# Altium project SC-FREYR-EPS-711, AstroYeast LED Flasher.PrjPcb
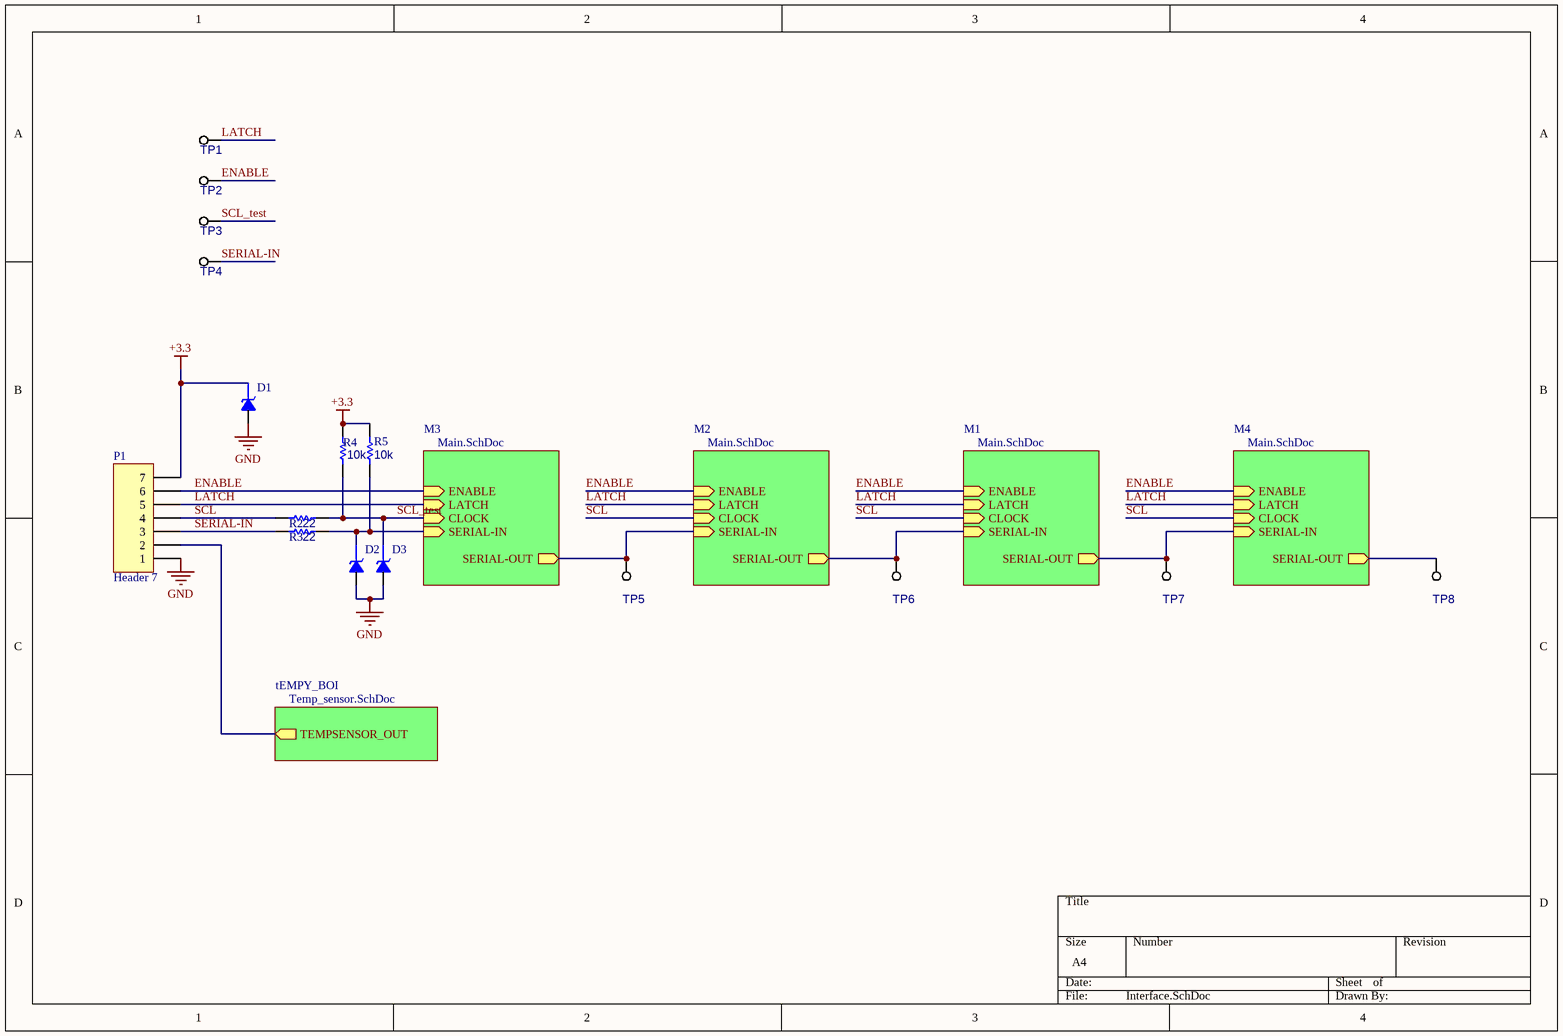
[diagram p0: Interface.SchDoc]
Circuit: AstroYeast LED Flasher; DrawingNumber: SC-FREYR-EPS-711; Project: SC-FREYR; Rev: A; RevDate: SUMMER 2023
5 sheets, 82 parts. Net scope: hierarchical (ports join the sheet entries above them; power ports are global).
Board files: Array.PcbDoc, PCB1.PcbDoc, RevB.PcbDoc
Sheets:
  Interface.SchDoc
    M1 = Main.SchDoc
      D1 = LED.SchDoc
        A = LEDBlock.SchDoc
        B = LEDBlock.SchDoc
        C = LEDBlock.SchDoc
        D = LEDBlock.SchDoc
    M2 = Main.SchDoc
      D1 = LED.SchDoc
        A = LEDBlock.SchDoc
        B = LEDBlock.SchDoc
        C = LEDBlock.SchDoc
        D = LEDBlock.SchDoc
    M3 = Main.SchDoc
      D1 = LED.SchDoc
        A = LEDBlock.SchDoc
        B = LEDBlock.SchDoc
        C = LEDBlock.SchDoc
        D = LEDBlock.SchDoc
    M4 = Main.SchDoc
      D1 = LED.SchDoc
        A = LEDBlock.SchDoc
        B = LEDBlock.SchDoc
        C = LEDBlock.SchDoc
        D = LEDBlock.SchDoc
    tEMPY_BOI = Temp_sensor.SchDoc

## Sheet Interface.SchDoc
size A4; SheetNumber: 1; SheetTotal: 5

### Parts
D1  STS521033B950  [STS521033B950_COB]  (value not drawn)
D2  STS521033B950  [STS521033B950_COB]  (value not drawn)
D3  STS521033B950  [STS521033B950_COB]  (value not drawn)
P1  Header 7  [HDR1X7]
R2  value 22  [R0603A]  (hidden comment: Resistor)
R3  value 22  [R0603A]  (hidden comment: Resistor)
R4  value 10k  [R0603A]  (hidden comment: Resistor)
R5  value 10k  [R0603A]  (hidden comment: Resistor)
TP1  Test Point  [TP-SMT-1mm]  (value not drawn)  (no BOM)
TP2  Test Point  [TP-SMT-1mm]  (value not drawn)  (no BOM)
TP3  Test Point  [TP-SMT-1mm]  (value not drawn)  (no BOM)
TP4  Test Point  [TP-SMT-1mm]  (value not drawn)  (no BOM)
TP5  Test Point  [TP-SMT-1mm]  (value not drawn)  (no BOM)
TP6  Test Point  [TP-SMT-1mm]  (value not drawn)  (no BOM)
TP7  Test Point  [TP-SMT-1mm]  (value not drawn)  (no BOM)
TP8  Test Point  [TP-SMT-1mm]  (value not drawn)  (no BOM)

### Sub-sheets
M1 = Main.SchDoc: LATCH (in), ENABLE (in), CLOCK (in), SERIAL-IN (in), SERIAL-OUT (out)
M2 = Main.SchDoc: LATCH (in), ENABLE (in), CLOCK (in), SERIAL-IN (in), SERIAL-OUT (out)
M3 = Main.SchDoc: LATCH (in), ENABLE (in), CLOCK (in), SERIAL-IN (in), SERIAL-OUT (out)
M4 = Main.SchDoc: LATCH (in), ENABLE (in), CLOCK (in), SERIAL-IN (in), SERIAL-OUT (out)
tEMPY_BOI = Temp_sensor.SchDoc: TEMPSENSOR_OUT (out)

### Nets
+3.3: D1.1(K) P1.7 R4.1 R5.1
GND: D1.2(A) D2.2(A) D3.2(A) P1.1
ENABLE: P1.6 TP2.1(Pad) ; sheet M1/ENABLE, sheet M2/ENABLE, sheet M3/ENABLE, sheet M4/ENABLE
LATCH: P1.5 TP1.1(Pad) ; sheet M1/LATCH, sheet M2/LATCH, sheet M3/LATCH, sheet M4/LATCH
SCL: P1.4 R2.2 ; sheet M1/CLOCK, sheet M2/CLOCK, sheet M4/CLOCK
SCL_test: D3.1(K) R2.1 R4.2 TP3.1(Pad) ; sheet M3/CLOCK  [project net SCL]
SDA: TP5.1(Pad) ; sheet M2/SERIAL-IN, sheet M3/SERIAL-OUT
SDA: TP6.1(Pad) ; sheet M1/SERIAL-IN, sheet M2/SERIAL-OUT  [a separate net that carries the same name]
SDA: TP7.1(Pad) ; sheet M1/SERIAL-OUT, sheet M4/SERIAL-IN  [a separate net that carries the same name]
SDA: D2.1(K) R3.1 R5.2 ; sheet M3/SERIAL-IN  [a separate net that carries the same name]
SERIAL-IN: P1.3 R3.2 TP4.1(Pad)
SERIAL-OUT: TP8.1(Pad) ; sheet M4/SERIAL-OUT
TEMPSENSOR_OUT: P1.2 ; sheet tEMPY_BOI/TEMPSENSOR_OUT

### Library data of the parts
D1-D3 = CMP-245-000001-7: 3.3V ESD Diode; Mfr_Name: Eaton / Cooper Bussmann; Type: DEV; Copyright: Copyright (C) 2023 Ultra Librarian. All rights reserved.; RefDes: RefDes; Manufacturer_Part_Number: STS521033B950; Design Item ID: STS521033B950; Source: STS521033B950.SchLib
P1 = CMP-005-000112-1: Header, 7-Pin; Signal Integrity: Connector; Design Item ID: Header 7; Component Type: Standard; Source: Miscellaneous Connectors.SchLib; LatestRevisionDate: 17-Jul-2002; LatestRevisionNote: Re-released for DXP Platform.; Publisher: Altium Limited; Pin Count: 7
R2-R5 = CMP-009-00002-14
TP1-TP8 = CMP-002-00006-5: In circuit test point for a net

## Sheet Main.SchDoc
size A4; SheetNumber: 2; SheetTotal: 5
Used 4 times, as channels M1, M2, M3, M4. Parts and nets are listed once, with the designators drawn on the sheet.
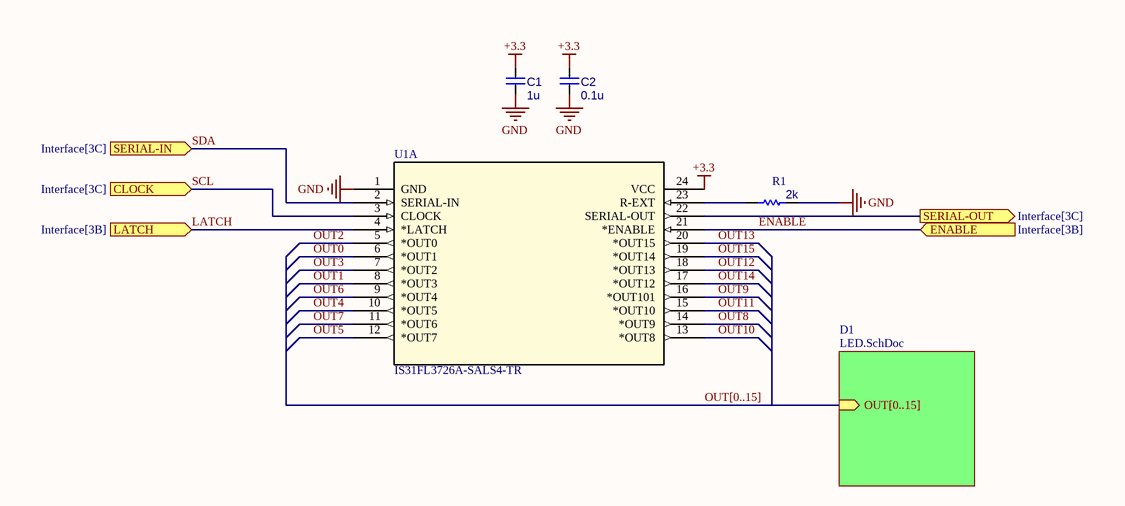
[diagram p1: Main.SchDoc]

### Parts
C1  value 1u  [C0603B]  (hidden comment: Capacitor)
C2  value 0.1u  [C0603B]  (hidden comment: Capacitor)
R1  value 2k  [R0603B]  (hidden comment: Resistor)
U1  IS31FL3726A-SALS4-TR  [SSOP-24_LMS]  (part A of 2)

### Sub-sheets
D1 = LED.SchDoc: OUT[0..15] (in)

### Ports
CLOCK (in, see Interface[3C]), ENABLE (in, see Interface[3B]), LATCH (in, see Interface[3B]), SERIAL-IN (in, see Interface[3C]), SERIAL-OUT (out, see Interface[3C])

### Nets
+3.3: C1.1 C2.1 U1.24(VCC)
GND: C1.2 C2.2 R1.2 U1.1(GND)
ENABLE: U1.21(*ENABLE) ; port ENABLE
LATCH: U1.4(*LATCH) ; port LATCH
OUT0: U1.6(*OUT1)
OUT1: U1.8(*OUT3)
OUT2: U1.5(*OUT0)
OUT3: U1.7(*OUT2)
OUT4: U1.10(*OUT5)
OUT5: U1.12(*OUT7)
OUT6: U1.9(*OUT4)
OUT7: U1.11(*OUT6)
OUT8: U1.14(*OUT9)
OUT9: U1.16(*OUT101)
OUT10: U1.13(*OUT8)
OUT11: U1.15(*OUT10)
OUT12: U1.18(*OUT13)
OUT13: U1.20(*OUT15)
OUT14: U1.17(*OUT12)
OUT15: U1.19(*OUT14)
SCL: U1.3(CLOCK) ; port CLOCK
SDA: U1.2(SERIAL-IN) ; port SERIAL-IN
SERIAL-OUT: U1.22(SERIAL-OUT) ; port SERIAL-OUT
NetR1_1: R1.1 U1.23(R-EXT)

### Channels
M1: designators end in _M1; ports CLOCK=SCL ENABLE=ENABLE LATCH=LATCH SERIAL-IN=SDA SERIAL-OUT=SDA
M2: designators end in _M2; ports CLOCK=SCL ENABLE=ENABLE LATCH=LATCH SERIAL-IN=SDA SERIAL-OUT=SDA
M3: designators end in _M3; ports CLOCK=SCL ENABLE=ENABLE LATCH=LATCH SERIAL-IN=SDA SERIAL-OUT=SDA
M4: designators end in _M4; ports CLOCK=SCL ENABLE=ENABLE LATCH=LATCH SERIAL-IN=SDA SERIAL-OUT=SERIAL-OUT

### Buses and harness runs
bus OUT[0..15] = sheet D1/OUT[0..15]

### Library data of the parts
C1 C2 = CMP-001-00000-10: Non-polarized capacitor
R1 = CMP-009-00002-14
U1 = CMP-184-000001-2: LED Driver IC 16 Output Linear Shift Register No Dimming 25.2mA 24-eTSSOP; Mfr_Name: Lumissil Microsystems; RefDes: RefDes; Design Item ID: IS31FL3726A-SALS4-TR; Type: Type; Source: IS31FL3726A-SALS4-TR.SchLib

## Sheet LED.SchDoc
size A4; SheetNumber: 3; SheetTotal: 4
Used 4 times, as channels M1/D1, M2/D1, M3/D1, M4/D1. Parts and nets are listed once, with the designators drawn on the sheet.
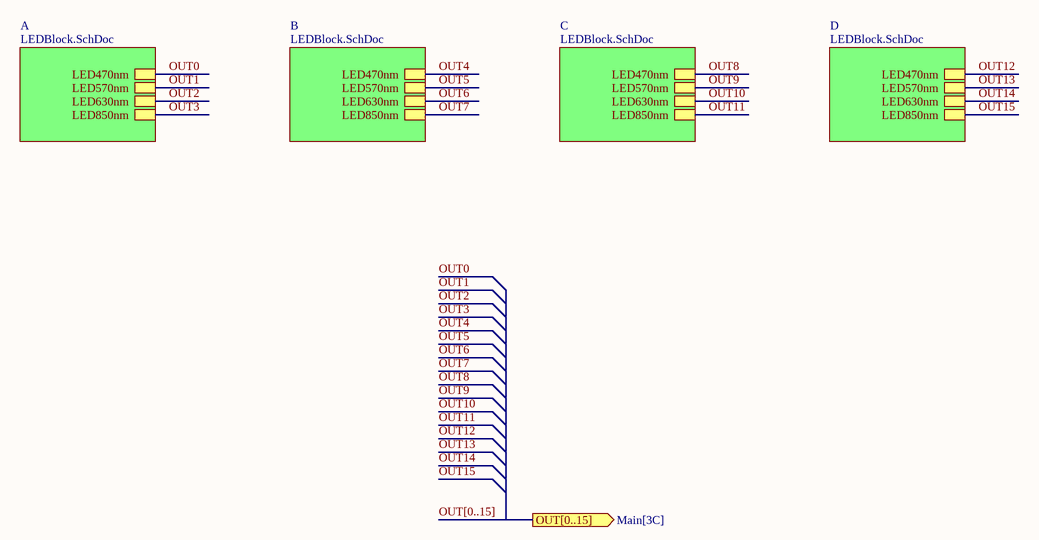
[diagram p2: LED.SchDoc]

### Sub-sheets
A = LEDBlock.SchDoc: LED470nm, LED570nm, LED630nm, LED850nm
B = LEDBlock.SchDoc: LED470nm, LED570nm, LED630nm, LED850nm
C = LEDBlock.SchDoc: LED470nm, LED570nm, LED630nm, LED850nm
D = LEDBlock.SchDoc: LED470nm, LED570nm, LED630nm, LED850nm

### Ports
OUT[0..15] (out, see Main[3C])

### Channels
M1/D1: no parts or ports
M2/D1: no parts or ports
M3/D1: no parts or ports
M4/D1: no parts or ports

### Buses and harness runs
bus OUT[0..15] = port OUT[0..15]

## Sheet LEDBlock.SchDoc
size A4; SheetNumber: 4; SheetTotal: 5
Used 16 times, as channels M1/D1/A, M1/D1/B, M1/D1/C, M1/D1/D, M2/D1/A, M2/D1/B, M2/D1/C, M2/D1/D, M3/D1/A, M3/D1/B, M3/D1/C, M3/D1/D, M4/D1/A, M4/D1/B, M4/D1/C, M4/D1/D. Parts and nets are listed once, with the designators drawn on the sheet.
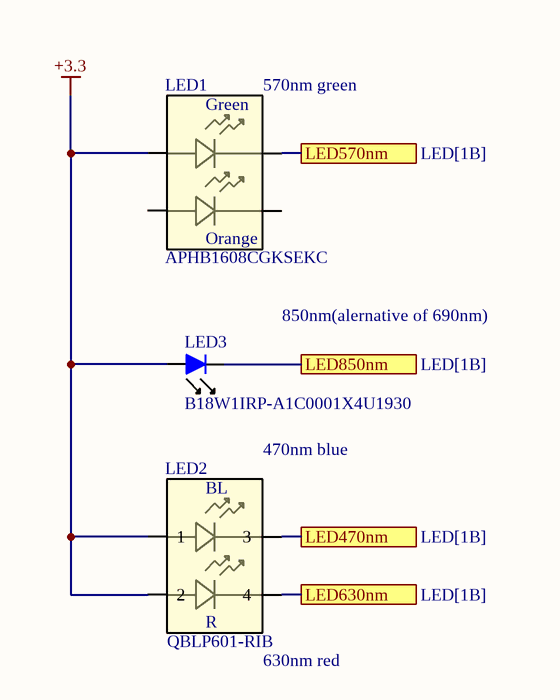
[diagram p3: LEDBlock.SchDoc]

### Parts
LED1  APHB1608CGKSEKC  [APHB1608CGKSEKC_KNB]
LED2  QBLP601-RIB  [DFN65P160X55-4N]
LED3  B18W1IRP-A1C0001X4U1930  [CAPCP1608X10N]

### Ports
LED470nm (see LED[1B]), LED570nm (see LED[1B]), LED630nm (see LED[1B]), LED850nm (see LED[1B])

### Nets
+3.3: LED1.1 LED2.1 LED2.2 LED3.2(A)
LED470nm: LED2.3 ; port LED470nm
LED570nm: LED1.2 ; port LED570nm
LED630nm: LED2.4 ; port LED630nm
LED850nm: LED3.1(K) ; port LED850nm

Not connected (* = marked no-connect by the designer): LED1 3 4

### Channels
M1/D1/A: designators end in _A1; ports LED470nm=OUT0_M1 LED570nm=OUT1_M1 LED630nm=OUT2_M1 LED850nm=OUT3_M1
M1/D1/B: designators end in _B1; ports LED470nm=OUT4_M1 LED570nm=OUT5_M1 LED630nm=OUT6_M1 LED850nm=OUT7_M1
M1/D1/C: designators end in _C1; ports LED470nm=OUT8_M1 LED570nm=OUT9_M1 LED630nm=OUT10_M1 LED850nm=OUT11_M1
M1/D1/D: designators end in _D1; ports LED470nm=OUT12_M1 LED570nm=OUT13_M1 LED630nm=OUT14_M1 LED850nm=OUT15_M1
M2/D1/A: designators end in _A2; ports LED470nm=OUT0_M2 LED570nm=OUT1_M2 LED630nm=OUT2_M2 LED850nm=OUT3_M2
M2/D1/B: designators end in _B2; ports LED470nm=OUT4_M2 LED570nm=OUT5_M2 LED630nm=OUT6_M2 LED850nm=OUT7_M2
M2/D1/C: designators end in _C2; ports LED470nm=OUT8_M2 LED570nm=OUT9_M2 LED630nm=OUT10_M2 LED850nm=OUT11_M2
M2/D1/D: designators end in _D2; ports LED470nm=OUT12_M2 LED570nm=OUT13_M2 LED630nm=OUT14_M2 LED850nm=OUT15_M2
M3/D1/A: designators end in _A3; ports LED470nm=OUT0_M3 LED570nm=OUT1_M3 LED630nm=OUT2_M3 LED850nm=OUT3_M3
M3/D1/B: designators end in _B3; ports LED470nm=OUT4_M3 LED570nm=OUT5_M3 LED630nm=OUT6_M3 LED850nm=OUT7_M3
M3/D1/C: designators end in _C3; ports LED470nm=OUT8_M3 LED570nm=OUT9_M3 LED630nm=OUT10_M3 LED850nm=OUT11_M3
M3/D1/D: designators end in _D3; ports LED470nm=OUT12_M3 LED570nm=OUT13_M3 LED630nm=OUT14_M3 LED850nm=OUT15_M3
M4/D1/A: designators end in _A4; ports LED470nm=OUT0_M4 LED570nm=OUT1_M4 LED630nm=OUT2_M4 LED850nm=OUT3_M4
M4/D1/B: designators end in _B4; ports LED470nm=OUT4_M4 LED570nm=OUT5_M4 LED630nm=OUT6_M4 LED850nm=OUT7_M4
M4/D1/C: designators end in _C4; ports LED470nm=OUT8_M4 LED570nm=OUT9_M4 LED630nm=OUT10_M4 LED850nm=OUT11_M4
M4/D1/D: designators end in _D4; ports LED470nm=OUT12_M4 LED570nm=OUT13_M4 LED630nm=OUT14_M4 LED850nm=OUT15_M4

### Notes on the sheet
- (near LED1) 570nm green
- 850nm(alernative of 690nm)
- 470nm blue
- (near LED2) 630nm red
- (in symbol CMP-007-00006-3) Green; Orange
- (in symbol CMP-007-00009-2) BL; R

### Library data of the parts
LED1 = CMP-007-00006-3: Dual Color LED, Super Bright Orange/green, Water Clear, 1.6mm; Mfr_Name: Kingbright; RoHS Compliant: Yes; Source: APHB1608CGKSEKC.SchLib; Design Item ID: APHB1608CGKSEKC
LED2 = CMP-007-00009-2: Blue, Red 470nm Blue, 630nm Red LED Indication - Discrete 3.1V Blue, 2V Red 0603 (1608 Metric)
LED3 = CMP-007-00008-2: Infrared (IR) Emitter 850nm 1.7V 100mA 23mW/sr @ 100mA (Typ) 80° 0603 (1608 Metric)

## Sheet Temp_sensor.SchDoc
size A; SheetNumber: 5; SheetTotal: 5
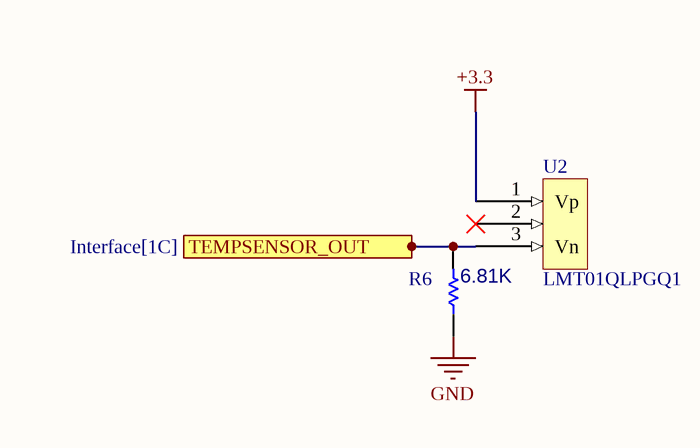
[diagram p4: Temp_sensor.SchDoc]

### Parts
R6  value 6.81K  [R0603A]  (hidden comment: Resistor)
U2  LMT01QLPGQ1  [LMT01-Q1]

### Ports
TEMPSENSOR_OUT (out, see Interface[1C])

### Nets
+3.3: U2.1(Vp)
GND: R6.1
TEMPSENSOR_OUT: R6.2 U2.3(Vn) ; port TEMPSENSOR_OUT

Not connected (* = marked no-connect by the designer): U2 2*

### Library data of the parts
R6 = CMP-009-00002-14
U2 = CMP-010-00023-4: Serial Switch/Digital Sensor, 13 Bit(s), 0.75Cel, Rectangular, Through Hole Mount; Max Supply Voltage: 5.5V; Sensor Type: TEMPERATURE SENSOR,SWITCH/DIGITAL OUTPUT,SERIAL; Min Supply Voltage: 2V; Min Operating Temperature: -40°C; Max Operating Temperature: 125°C; Mounting Technology: Through Hole; Datasheet: https://www.ti.com/lit/ds/symlink/lmt01-q1.pdf?HQS=dis-dk-null-digikeymode-dsf-pf-null-wwe&ts=1697411055213&ref_url=https%253A%252F%252Fwww.ti.com%252Fgeneral%252Fdocs%252Fsuppproductinfo.tsp%253FdistId%253D10%2526gotoUrl%253Dhttps%253A%252F%252Fwww.ti.com%252Flit%252Fgpn%252Flmt01-q1; RoHS Compliant: Yes

## Nets that join several sheets
+3.3: Interface (D1.1 P1.7 R4.1 R5.1), M1 (C1_M1.1 C2_M1.1 U1_M1.24), M1/D1/A (LED1_A1.1 LED2_A1.1 LED2_A1.2 LED3_A1.2), M1/D1/B (LED1_B1.1 LED2_B1.1 LED2_B1.2 LED3_B1.2), M1/D1/C (LED1_C1.1 LED2_C1.1 LED2_C1.2 LED3_C1.2), M1/D1/D (LED1_D1.1 LED2_D1.1 LED2_D1.2 LED3_D1.2), M2 (C1_M2.1 C2_M2.1 U1_M2.24), M2/D1/A (LED1_A2.1 LED2_A2.1 LED2_A2.2 LED3_A2.2), M2/D1/B (LED1_B2.1 LED2_B2.1 LED2_B2.2 LED3_B2.2), M2/D1/C (LED1_C2.1 LED2_C2.1 LED2_C2.2 LED3_C2.2), M2/D1/D (LED1_D2.1 LED2_D2.1 LED2_D2.2 LED3_D2.2), M3 (C1_M3.1 C2_M3.1 U1_M3.24), M3/D1/A (LED1_A3.1 LED2_A3.1 LED2_A3.2 LED3_A3.2), M3/D1/B (LED1_B3.1 LED2_B3.1 LED2_B3.2 LED3_B3.2), M3/D1/C (LED1_C3.1 LED2_C3.1 LED2_C3.2 LED3_C3.2), M3/D1/D (LED1_D3.1 LED2_D3.1 LED2_D3.2 LED3_D3.2), M4 (C1_M4.1 C2_M4.1 U1_M4.24), M4/D1/A (LED1_A4.1 LED2_A4.1 LED2_A4.2 LED3_A4.2), M4/D1/B (LED1_B4.1 LED2_B4.1 LED2_B4.2 LED3_B4.2), M4/D1/C (LED1_C4.1 LED2_C4.1 LED2_C4.2 LED3_C4.2), M4/D1/D (LED1_D4.1 LED2_D4.1 LED2_D4.2 LED3_D4.2), Temp_sensor (U2.1)
GND: Interface (D1.2 D2.2 D3.2 P1.1), M1 (C1_M1.2 C2_M1.2 R1_M1.2 U1_M1.1), M2 (C1_M2.2 C2_M2.2 R1_M2.2 U1_M2.1), M3 (C1_M3.2 C2_M3.2 R1_M3.2 U1_M3.1), M4 (C1_M4.2 C2_M4.2 R1_M4.2 U1_M4.1), Temp_sensor (R6.1)
ENABLE: Interface (P1.6 TP2.1), M1 (U1_M1.21), M2 (U1_M2.21), M3 (U1_M3.21), M4 (U1_M4.21)
LATCH: Interface (P1.5 TP1.1), M1 (U1_M1.4), M2 (U1_M2.4), M3 (U1_M3.4), M4 (U1_M4.4)
OUT0_M1: M1 (U1_M1.6), M1/D1/A (LED2_A1.3)
OUT0_M2: M2 (U1_M2.6), M2/D1/A (LED2_A2.3)
OUT0_M3: M3 (U1_M3.6), M3/D1/A (LED2_A3.3)
OUT0_M4: M4 (U1_M4.6), M4/D1/A (LED2_A4.3)
OUT1_M1: M1 (U1_M1.8), M1/D1/A (LED1_A1.2)
OUT1_M2: M2 (U1_M2.8), M2/D1/A (LED1_A2.2)
OUT1_M3: M3 (U1_M3.8), M3/D1/A (LED1_A3.2)
OUT1_M4: M4 (U1_M4.8), M4/D1/A (LED1_A4.2)
OUT2_M1: M1 (U1_M1.5), M1/D1/A (LED2_A1.4)
OUT2_M2: M2 (U1_M2.5), M2/D1/A (LED2_A2.4)
OUT2_M3: M3 (U1_M3.5), M3/D1/A (LED2_A3.4)
OUT2_M4: M4 (U1_M4.5), M4/D1/A (LED2_A4.4)
OUT3_M1: M1 (U1_M1.7), M1/D1/A (LED3_A1.1)
OUT3_M2: M2 (U1_M2.7), M2/D1/A (LED3_A2.1)
OUT3_M3: M3 (U1_M3.7), M3/D1/A (LED3_A3.1)
OUT3_M4: M4 (U1_M4.7), M4/D1/A (LED3_A4.1)
OUT4_M1: M1 (U1_M1.10), M1/D1/B (LED2_B1.3)
OUT4_M2: M2 (U1_M2.10), M2/D1/B (LED2_B2.3)
OUT4_M3: M3 (U1_M3.10), M3/D1/B (LED2_B3.3)
OUT4_M4: M4 (U1_M4.10), M4/D1/B (LED2_B4.3)
OUT5_M1: M1 (U1_M1.12), M1/D1/B (LED1_B1.2)
OUT5_M2: M2 (U1_M2.12), M2/D1/B (LED1_B2.2)
OUT5_M3: M3 (U1_M3.12), M3/D1/B (LED1_B3.2)
OUT5_M4: M4 (U1_M4.12), M4/D1/B (LED1_B4.2)
OUT6_M1: M1 (U1_M1.9), M1/D1/B (LED2_B1.4)
OUT6_M2: M2 (U1_M2.9), M2/D1/B (LED2_B2.4)
OUT6_M3: M3 (U1_M3.9), M3/D1/B (LED2_B3.4)
OUT6_M4: M4 (U1_M4.9), M4/D1/B (LED2_B4.4)
OUT7_M1: M1 (U1_M1.11), M1/D1/B (LED3_B1.1)
OUT7_M2: M2 (U1_M2.11), M2/D1/B (LED3_B2.1)
OUT7_M3: M3 (U1_M3.11), M3/D1/B (LED3_B3.1)
OUT7_M4: M4 (U1_M4.11), M4/D1/B (LED3_B4.1)
OUT8_M1: M1 (U1_M1.14), M1/D1/C (LED2_C1.3)
OUT8_M2: M2 (U1_M2.14), M2/D1/C (LED2_C2.3)
OUT8_M3: M3 (U1_M3.14), M3/D1/C (LED2_C3.3)
OUT8_M4: M4 (U1_M4.14), M4/D1/C (LED2_C4.3)
OUT9_M1: M1 (U1_M1.16), M1/D1/C (LED1_C1.2)
OUT9_M2: M2 (U1_M2.16), M2/D1/C (LED1_C2.2)
OUT9_M3: M3 (U1_M3.16), M3/D1/C (LED1_C3.2)
OUT9_M4: M4 (U1_M4.16), M4/D1/C (LED1_C4.2)
OUT10_M1: M1 (U1_M1.13), M1/D1/C (LED2_C1.4)
OUT10_M2: M2 (U1_M2.13), M2/D1/C (LED2_C2.4)
OUT10_M3: M3 (U1_M3.13), M3/D1/C (LED2_C3.4)
OUT10_M4: M4 (U1_M4.13), M4/D1/C (LED2_C4.4)
OUT11_M1: M1 (U1_M1.15), M1/D1/C (LED3_C1.1)
OUT11_M2: M2 (U1_M2.15), M2/D1/C (LED3_C2.1)
OUT11_M3: M3 (U1_M3.15), M3/D1/C (LED3_C3.1)
OUT11_M4: M4 (U1_M4.15), M4/D1/C (LED3_C4.1)
OUT12_M1: M1 (U1_M1.18), M1/D1/D (LED2_D1.3)
OUT12_M2: M2 (U1_M2.18), M2/D1/D (LED2_D2.3)
OUT12_M3: M3 (U1_M3.18), M3/D1/D (LED2_D3.3)
OUT12_M4: M4 (U1_M4.18), M4/D1/D (LED2_D4.3)
OUT13_M1: M1 (U1_M1.20), M1/D1/D (LED1_D1.2)
OUT13_M2: M2 (U1_M2.20), M2/D1/D (LED1_D2.2)
OUT13_M3: M3 (U1_M3.20), M3/D1/D (LED1_D3.2)
OUT13_M4: M4 (U1_M4.20), M4/D1/D (LED1_D4.2)
OUT14_M1: M1 (U1_M1.17), M1/D1/D (LED2_D1.4)
OUT14_M2: M2 (U1_M2.17), M2/D1/D (LED2_D2.4)
OUT14_M3: M3 (U1_M3.17), M3/D1/D (LED2_D3.4)
OUT14_M4: M4 (U1_M4.17), M4/D1/D (LED2_D4.4)
OUT15_M1: M1 (U1_M1.19), M1/D1/D (LED3_D1.1)
OUT15_M2: M2 (U1_M2.19), M2/D1/D (LED3_D2.1)
OUT15_M3: M3 (U1_M3.19), M3/D1/D (LED3_D3.1)
OUT15_M4: M4 (U1_M4.19), M4/D1/D (LED3_D4.1)
SCL: Interface (D3.1 R2.1 R4.2 TP3.1), M3 (U1_M3.3)
SCL: Interface (P1.4 R2.2), M1 (U1_M1.3), M2 (U1_M2.3), M4 (U1_M4.3)
SDA: Interface (TP5.1), M2 (U1_M2.2), M3 (U1_M3.22)
SDA: Interface (TP6.1), M1 (U1_M1.2), M2 (U1_M2.22)
SDA: Interface (TP7.1), M1 (U1_M1.22), M4 (U1_M4.2)
SDA: Interface (D2.1 R3.1 R5.2), M3 (U1_M3.2)
SERIAL-OUT: Interface (TP8.1), M4 (U1_M4.22)
TEMPSENSOR_OUT: Interface (P1.2), Temp_sensor (R6.2 U2.3)